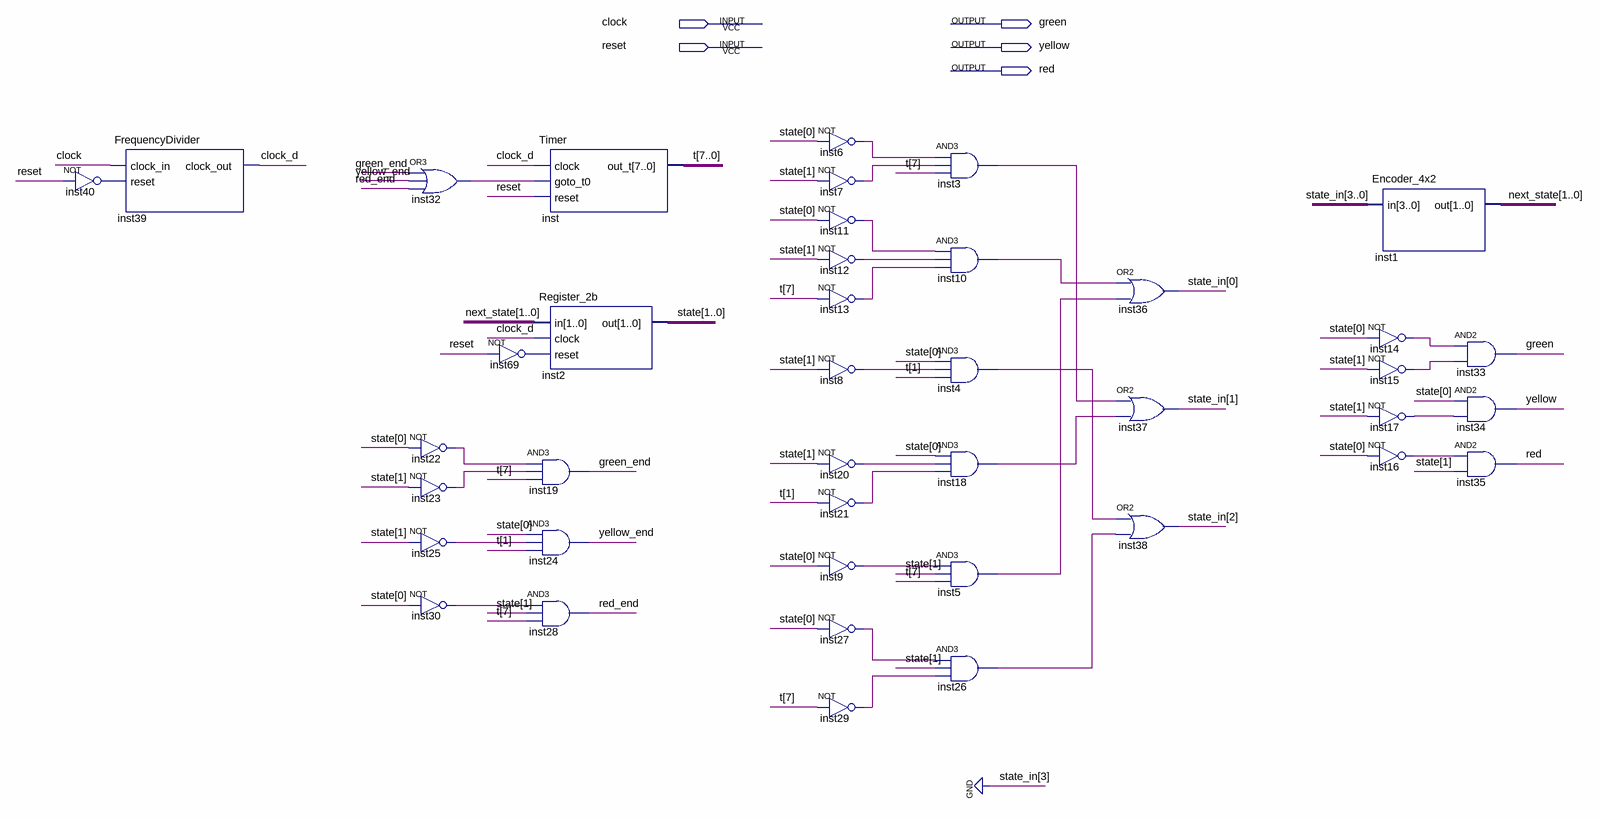
[diagram p0: schematic sheet]
// Quartus schematic SemaphoreControlSystem.bdf as structural Verilog: 41 symbols, 5 pins
module SemaphoreControlSystem (
  input  clock,
  input  reset,
  output green,
  output yellow,
  output red
);

  wire clock_d, green_end, inst3_out, inst4_out, inst5_out, inst6_out, inst7_out, inst8_out, inst9_out,
       inst10_out, inst11_out, inst12_out, inst13_out, inst14_out, inst15_out, inst16_out, inst17_out,
       inst18_out, inst20_out, inst21_out, inst22_out, inst23_out, inst25_out, inst26_out, inst27_out,
       inst29_out, inst30_out, inst32_out, inst40_out, inst69_out, red_end, yellow_end;
  wire [1:0] next_state, state;
  wire [2:0] state_in;
  wire [7:0] t;

  not inst40 (inst40_out, reset);
  FrequencyDivider inst39 (.clock_in(clock), .reset(inst40_out), .clock_out(clock_d));
  or inst32 (inst32_out, green_end, yellow_end, red_end);
  not inst22 (inst22_out, state[0]);
  not inst23 (inst23_out, state[1]);
  not inst25 (inst25_out, state[1]);
  not inst30 (inst30_out, state[0]);
  Timer inst (.clock(clock_d), .goto_t0(inst32_out), .reset(reset), .out_t(t));
  Register_2b inst2 (.in(next_state), .clock(clock_d), .reset(inst69_out), .out(state));
  not inst69 (inst69_out, reset);
  and inst19 (green_end, inst22_out, inst23_out, t[7]);
  and inst24 (yellow_end, state[0], inst25_out, t[1]);
  and inst28 (red_end, inst30_out, state[1], t[7]);
  not inst6 (inst6_out, state[0]);
  not inst7 (inst7_out, state[1]);
  not inst11 (inst11_out, state[0]);
  not inst12 (inst12_out, state[1]);
  not inst13 (inst13_out, t[7]);
  not inst8 (inst8_out, state[1]);
  not inst20 (inst20_out, state[1]);
  not inst21 (inst21_out, t[1]);
  not inst9 (inst9_out, state[0]);
  not inst27 (inst27_out, state[0]);
  not inst29 (inst29_out, t[7]);
  and inst3 (inst3_out, inst6_out, inst7_out, t[7]);
  and inst10 (inst10_out, inst11_out, inst12_out, inst13_out);
  and inst4 (inst4_out, state[0], inst8_out, t[1]);
  and inst18 (inst18_out, state[0], inst20_out, inst21_out);
  and inst5 (inst5_out, inst9_out, state[1], t[7]);
  and inst26 (inst26_out, inst27_out, state[1], inst29_out);
  or inst36 (state_in[0], inst10_out, inst5_out);
  or inst37 (state_in[1], inst3_out, inst18_out);
  or inst38 (state_in[2], inst4_out, inst26_out);
  Encoder_4x2 inst1 (.in({1'b0, state_in}), .out(next_state));
  not inst14 (inst14_out, state[0]);
  not inst15 (inst15_out, state[1]);
  not inst17 (inst17_out, state[1]);
  not inst16 (inst16_out, state[0]);
  and inst33 (green, inst14_out, inst15_out);
  and inst34 (yellow, state[0], inst17_out);
  and inst35 (red, inst16_out, state[1]);
endmodule
